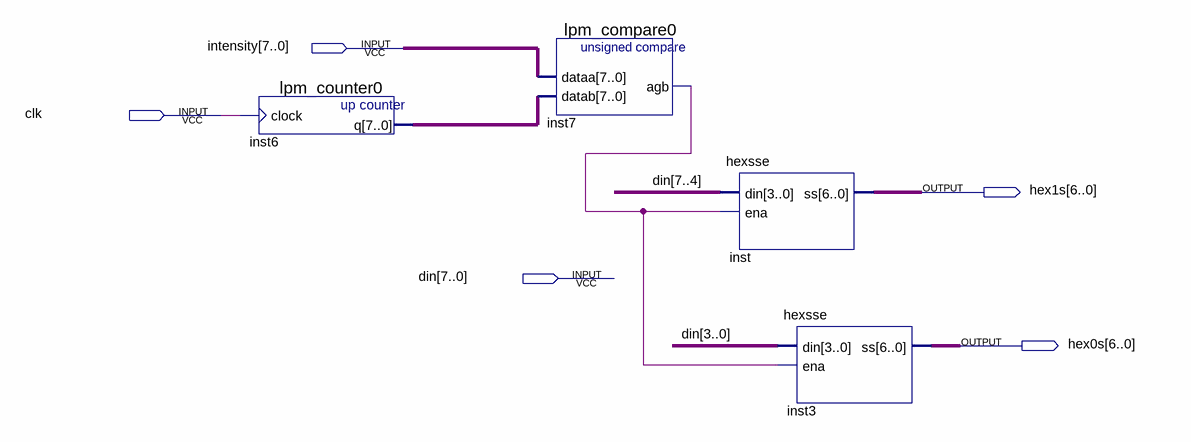
[diagram p0: schematic sheet]
// Quartus schematic test_hexss.bdf as structural Verilog: 4 symbols, 5 pins
module test_hexss (
  input  [7:0] intensity,
  input  clk,
  input  [7:0] din,
  output [6:0] hex1s,
  output [6:0] hex0s
);

  wire inst7_agb;
  wire [7:0] inst6_q;

  lpm_counter0 inst6 (.clock(clk), .q(inst6_q));
  lpm_compare0 inst7 (.dataa(intensity), .datab(inst6_q), .agb(inst7_agb));
  hexsse inst (.din(din[7:4]), .ena(inst7_agb), .ss(hex1s));
  hexsse inst3 (.din(din[3:0]), .ena(inst7_agb), .ss(hex0s));
endmodule
